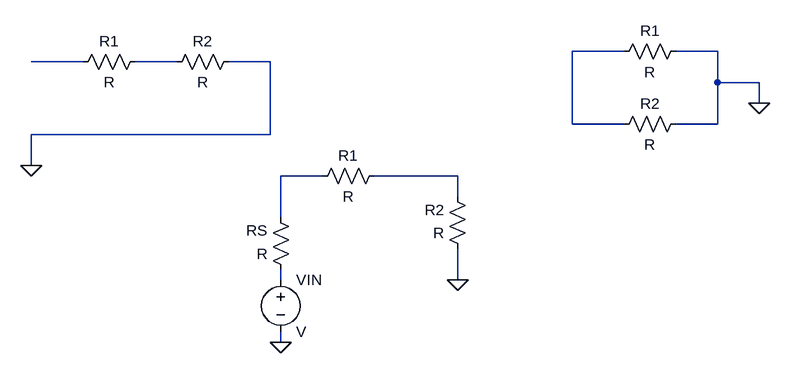
[diagram p0: schematic Draft1.asc]
Draft1.asc, the LTspice schematic file:
Version 4
SHEET 1 1204 680
WIRE 912 128 832 128
WIRE 1056 128 992 128
WIRE 80 144 0 144
WIRE 224 144 160 144
WIRE 368 144 304 144
WIRE 1056 176 1056 128
WIRE 1120 176 1056 176
WIRE 1120 208 1120 176
WIRE 832 240 832 128
WIRE 912 240 832 240
WIRE 1056 240 1056 176
WIRE 1056 240 992 240
WIRE 368 256 368 144
WIRE 368 256 0 256
WIRE 0 304 0 256
WIRE 448 320 384 320
WIRE 656 320 528 320
WIRE 656 352 656 320
WIRE 384 384 384 320
WIRE 384 480 384 464
WIRE 656 480 656 432
WIRE 384 576 384 560
FLAG 0 304 0
FLAG 1120 208 0
FLAG 656 480 0
FLAG 384 576 0
SYMBOL res 176 128 R90
WINDOW 0 0 56 VBottom 2
WINDOW 3 32 56 VTop 2
SYMATTR InstName R1
SYMBOL res 320 128 R90
WINDOW 0 0 56 VBottom 2
WINDOW 3 32 56 VTop 2
SYMATTR InstName R2
SYMBOL res 1008 112 R90
WINDOW 0 0 56 VBottom 2
WINDOW 3 32 56 VTop 2
SYMATTR InstName R1
SYMBOL res 1008 224 R90
WINDOW 0 0 56 VBottom 2
WINDOW 3 32 56 VTop 2
SYMATTR InstName R2
SYMBOL res 544 304 R90
WINDOW 0 0 56 VBottom 2
WINDOW 3 32 56 VTop 2
SYMATTR InstName R1
SYMBOL res 672 448 R180
WINDOW 0 36 76 Left 2
WINDOW 3 36 40 Left 2
SYMATTR InstName R2
SYMBOL voltage 384 464 R0
SYMATTR InstName VIN
SYMBOL res 400 480 R180
WINDOW 0 36 76 Left 2
WINDOW 3 36 40 Left 2
SYMATTR InstName RS

The netlist it stands for:
* Draft1.asc
R1 N003 N002 R
R2 0 N003 R
R1 0 N001 R
R2 0 N001 R
R1 N005 N004 R
R2 0 N005 R
VIN N006 0 V
RS N006 N004 R
.backanno
.end